# EAGLE design fast_shutdown_v5.0 (EAGLE 9.6.2)
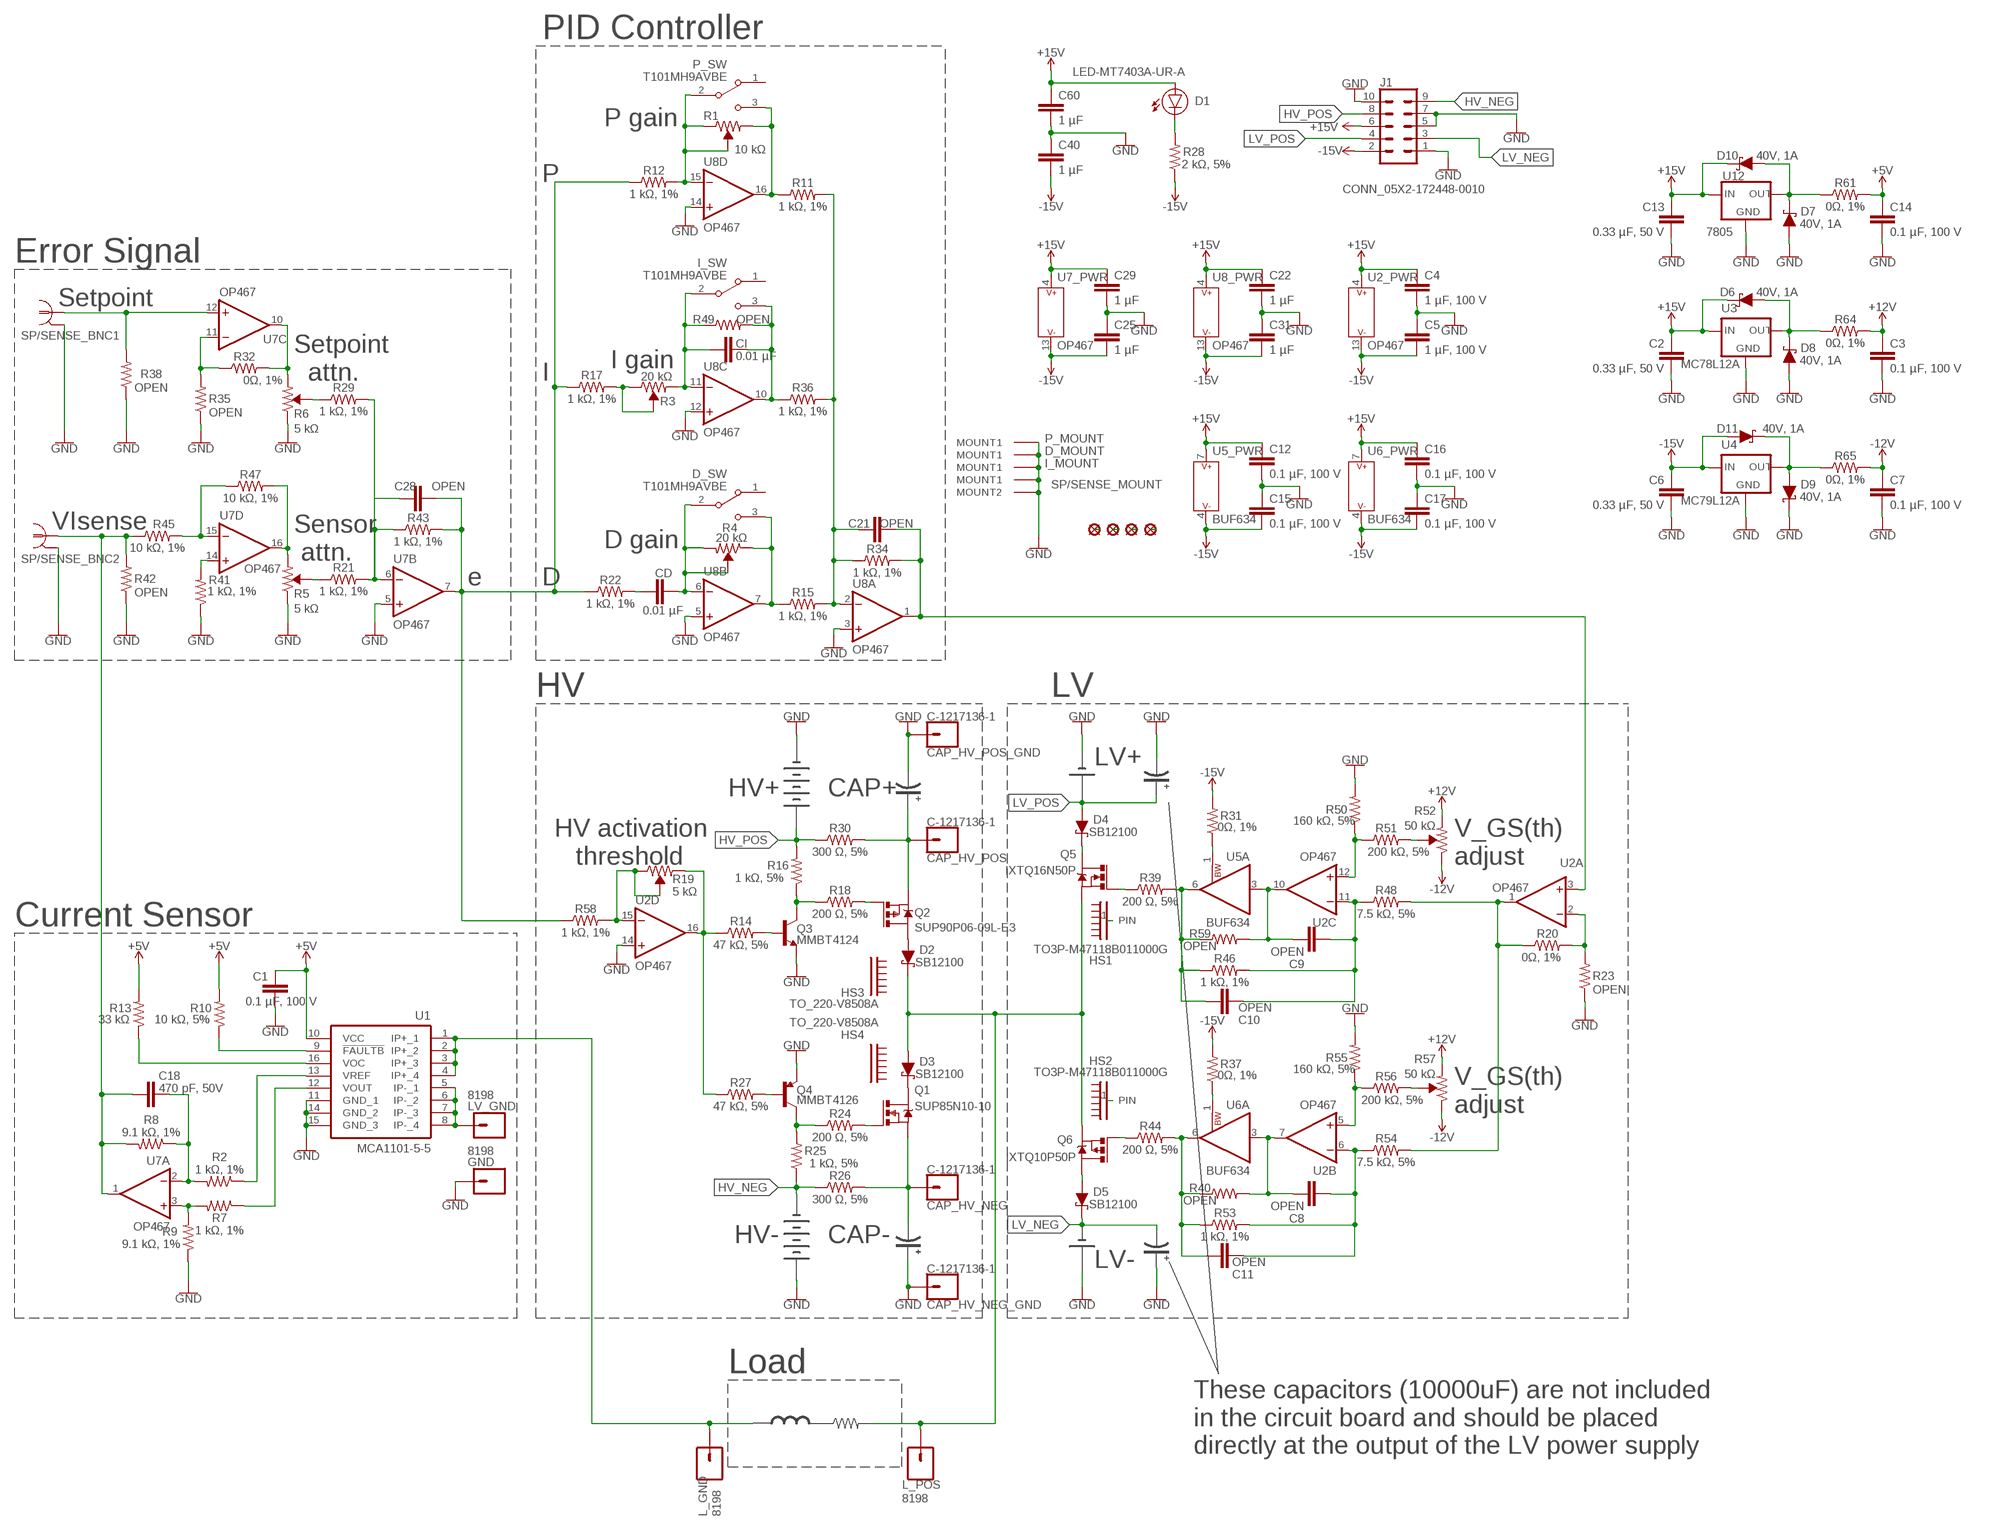
[diagram p0: schematic, sheet 1]

## Parts
C1  0.1 µF, 100 V  0.1µF-C1206C104J1RACTU  [C1206]
C2  0.33 µF, 50 V  0.33µF-CL31B334KBFNNNE  [C1206]
C3  0.1 µF, 100 V  0.1µF-C1206C104J1RACTU  [C1206]
C4  1 µF, 100 V  1µF-C1206X105J1RACTU  [C1206]
C5  1 µF, 100 V  1µF-C1206X105J1RACTU  [C1206]
C6  0.33 µF, 50 V  0.33µF-CL31B334KBFNNNE  [C1206]
C7  0.1 µF, 100 V  0.1µF-C1206C104J1RACTU  [C1206]
C8  OPEN  [C1206_OPEN]
C9  OPEN  [C1206_OPEN]
C10  OPEN  [C1206_OPEN]
C11  OPEN  [C1206_OPEN]
C12  0.1 µF, 100 V  0.1µF-C1206C104J1RACTU  [C1206]
C13  0.33 µF, 50 V  0.33µF-CL31B334KBFNNNE  [C1206]
C14  0.1 µF, 100 V  0.1µF-C1206C104J1RACTU  [C1206]
C15  0.1 µF, 100 V  0.1µF-C1206C104J1RACTU  [C1206]
C16  0.1 µF, 100 V  0.1µF-C1206C104J1RACTU  [C1206]
C17  0.1 µF, 100 V  0.1µF-C1206C104J1RACTU  [C1206]
C18  470 pF, 50V  470ρF-C1206C471K5RACTU  [C1206]
C21  OPEN  [C1206_OPEN]
C22  1 µF  1µF-C1206C105K3RACTU  [C1206]
C25  1 µF  1µF-C1206C105K3RACTU  [C1206]
C28  OPEN  [C1206_OPEN]
C29  1 µF  1µF-C1206C105K3RACTU  [C1206]
C31  1 µF  1µF-C1206C105K3RACTU  [C1206]
C40  1 µF  1µF-C1206C105K3RACTU  [C1206]
C60  1 µF  1µF-C1206C105K3RACTU  [C1206]
CAP_HV_NEG  C-1217136-1  [C-1217136-1]
CAP_HV_NEG_GND  C-1217136-1  [C-1217136-1]
CAP_HV_POS  C-1217136-1  [C-1217136-1]
CAP_HV_POS_GND  C-1217136-1  [C-1217136-1]
CD  0.01 µF  0.01µF-C1206C103K1RACTU  [C1206]
CI  0.01 µF  0.01µF-C1206C103K1RACTU  [C1206]
D  T101MH9AVBE  [T101MH9AVBE]
D1  LED-MT7403A-UR-A  [LED3MM]
D2  SB12100  DIODE_SCHOTTKY-SB12100  [D5.4X7.5]
D3  SB12100  DIODE_SCHOTTKY-SB12100  [D5.4X7.5]
D4  SB12100  DIODE_SCHOTTKY-SB12100  [D5.4X7.5]
D5  SB12100  DIODE_SCHOTTKY-SB12100  [D5.4X7.5]
D6  40V, 1A  DIODE_SCHOTTKY-RB168L-40TFTE25  [DO-214AC]
D7  40V, 1A  DIODE_SCHOTTKY-RB168L-40TFTE25  [DO-214AC]
D8  40V, 1A  DIODE_SCHOTTKY-RB168L-40TFTE25  [DO-214AC]
D9  40V, 1A  DIODE_SCHOTTKY-RB168L-40TFTE25  [DO-214AC]
D10  40V, 1A  DIODE_SCHOTTKY-RB168L-40TFTE25  [DO-214AC]
D11  40V, 1A  DIODE_SCHOTTKY-RB168L-40TFTE25  [DO-214AC]
GND  8198  [8198]
HS1  TO3P-M47118B011000G  [M47118B011000G]
HS2  TO3P-M47118B011000G  [M47118B011000G]
HS3  TO_220-V8508A  [V8508A]
HS4  TO_220-V8508A  [V8508A]
I  T101MH9AVBE  [T101MH9AVBE]
J1  CONN_05X2-172448-0010  [1724480010]
L_GND  8198  [8198]
L_POS  8198  [8198]
LV_GND  8198  [8198]
P  T101MH9AVBE  [T101MH9AVBE]
P1  PAD-M3.0  [PAD_M3.0]
P2  PAD-M3.0  [PAD_M3.0]
P3  PAD-M3.0  [PAD_M3.0]
P4  PAD-M3.0  [PAD_M3.0]
Q1  SUP85N10-10  MOSFET_N-SUP85N10-10-GE3  [TO220AB_BL]
Q2  SUP90P06-09L-E3  MOSFET_P-SUP90P06-09L-E3  [TO220AB_BL]
Q3  MMBT4124  BJT_NPN-MMBT4124LT1G  [SOT23]
Q4  MMBT4126  BJT_PNP-MMBT4126LT1G  [SOT23]
Q5  IXTQ16N50P  MOSFET_N-IXTQ16N50P  [TO3P]
Q6  IXTQ10P50P  MOSFET_P-IXTQ10P50P  [TO3P]
R1  10 kΩ  TRIMMER_3006P-10K  [POT_3006P]
R2  1 kΩ, 1%  1KΩ-RC1206FR-071KL  [R1206]
R3  20 kΩ  TRIMMER_3006P-20K  [POT_3006P]
R4  20 kΩ  TRIMMER_3006P-20K  [POT_3006P]
R5  5 kΩ  TRIMMER_3006P-5K  [POT_3006P]
R6  5 kΩ  TRIMMER_3006P-5K  [POT_3006P]
R7  1 kΩ, 1%  1KΩ-RC1206FR-071KL  [R1206]
R8  9.1 kΩ, 1%  9.1KΩ-RC1206FR-079K1L  [R1206]
R9  9.1 kΩ, 1%  9.1KΩ-RC1206FR-079K1L  [R1206]
R10  10 kΩ, 5%  10KΩ-RC1206JR-0710KL  [R1206]
R11  1 kΩ, 1%  1KΩ-RC1206FR-071KL  [R1206]
R12  1 kΩ, 1%  1KΩ-RC1206FR-071KL  [R1206]
R13  33 kΩ  NOVA  [R1206]
R14  47 kΩ, 5%  47KΩ-RC1206JR-0747KL  [R1206]
R15  1 kΩ, 1%  1KΩ-RC1206FR-071KL  [R1206]
R16  1 kΩ, 5%  1KΩ-RC1206JR-071KL  [R1206]
R17  1 kΩ, 1%  1KΩ-RC1206FR-071KL  [R1206]
R18  200 Ω, 5%  200Ω-RC1206JR-07200RL  [R1206]
R19  5 kΩ  TRIMMER_3006P-5K  [POT_3006P]
R20  0Ω, 1%  0Ω-RC1206FR-070RL  [R1206]
R21  1 kΩ, 1%  1KΩ-RC1206FR-071KL  [R1206]
R22  1 kΩ, 1%  1KΩ-RC1206FR-071KL  [R1206]
R23  OPEN  OPEN-1206  [R1206_OPEN]
R24  200 Ω, 5%  200Ω-RC1206JR-07200RL  [R1206]
R25  1 kΩ, 5%  1KΩ-RC1206JR-071KL  [R1206]
R26  300 Ω, 5%  300Ω-RC1206JR-07300RL  [R1206]
R27  47 kΩ, 5%  47KΩ-RC1206JR-0747KL  [R1206]
R28  2 kΩ, 5%  2KΩ-RC1206JR-072KL  [R1206]
R29  1 kΩ, 1%  1KΩ-RC1206FR-071KL  [R1206]
R30  300 Ω, 5%  300Ω-RC1206JR-07300RL  [R1206]
R31  0Ω, 1%  0Ω-RC1206FR-070RL  [R1206]
R32  0Ω, 1%  0Ω-RC1206FR-070RL  [R1206]
R34  1 kΩ, 1%  1KΩ-RC1206FR-071KL  [R1206]
R35  OPEN  OPEN-1206  [R1206_OPEN]
R36  1 kΩ, 1%  1KΩ-RC1206FR-071KL  [R1206]
R37  0Ω, 1%  0Ω-RC1206FR-070RL  [R1206]
R38  OPEN  OPEN-1206  [R1206_OPEN]
R39  200 Ω, 5%  200Ω-RC1206JR-07200RL  [R1206]
R40  OPEN  OPEN-1206  [R1206_OPEN]
R41  1 kΩ, 1%  1KΩ-RC1206FR-071KL  [R1206]
R42  OPEN  OPEN-1206  [R1206_OPEN]
R43  1 kΩ, 1%  1KΩ-RC1206FR-071KL  [R1206]
R44  200 Ω, 5%  200Ω-RC1206JR-07200RL  [R1206]
R45  10 kΩ, 1%  10KΩ-RC1206FR-0710KL  [R1206]
R46  1 kΩ, 1%  1KΩ-RC1206FR-071KL  [R1206]
R47  10 kΩ, 1%  10KΩ-RC1206FR-0710KL  [R1206]
R48  7.5 kΩ, 5%  7.5KΩ-RC1206JR-077K5L  [R1206]
R49  OPEN  OPEN-1206  [R1206_OPEN]
R50  160 kΩ, 5%  160KΩ-RC1206JR-07160KL  [R1206]
R51  200 kΩ, 5%  200KΩ-RC1206JR-07200KL  [R1206]
R52  50 kΩ  TRIMMER_3006P-50K  [POT_3006P]
R53  1 kΩ, 1%  1KΩ-RC1206FR-071KL  [R1206]
R54  7.5 kΩ, 5%  7.5KΩ-RC1206JR-077K5L  [R1206]
R55  160 kΩ, 5%  160KΩ-RC1206JR-07160KL  [R1206]
R56  200 kΩ, 5%  200KΩ-RC1206JR-07200KL  [R1206]
R57  50 kΩ  TRIMMER_3006P-50K  [POT_3006P]
R58  1 kΩ, 1%  1KΩ-RC1206FR-071KL  [R1206]
R59  OPEN  OPEN-1206  [R1206_OPEN]
R61  0Ω, 1%  0Ω-RC1206FR-070RL  [R1206]
R64  0Ω, 1%  0Ω-RC1206FR-070RL  [R1206]
R65  0Ω, 1%  0Ω-RC1206FR-070RL  [R1206]
SP/SENSE  BNC2_CHG-5227161-1  [5227161-1_CHG]
U1  MCA1101-5-5  MCA1101-5-5-MCA1101-5-5  [SOIC16-W]
U2  OP467  OP467-OP467GSZ  [SOIC16-W]
U3  MC78L12A  MC78L12A-MC78L12ABDR2G  [SOIC8-N]
U4  MC79L12A  MC79L12A-MC79L12ABDR2G  [SOIC8-N]
U5  BUF634  BUF634-BUF634AIDR  [SOIC8-N]
U6  BUF634  BUF634-BUF634AIDR  [SOIC8-N]
U7  OP467  OP467-OP467GSZ  [SOIC16-W]
U8  OP467  OP467-OP467GSZ  [SOIC16-W]
U12  7805  MC7805CT-L7805CDT-TR  [DPAK]

## Nets
+5V: C1.1 C14.1 R10.2 R13.2 R61.2 U1.10(VCC)
+12V: C3.1 R52.1(CCW) R57.1(CCW) R64.2
+15V: C2.1 C4.1 C12.1 C13.1 C16.1 C22.1 C29.1 C60.1 D1.A D6.K(C) D10.K(C) J1.6 U2.4(_PWR:P$V+) U3.8(IN) U5.7(_PWR:P$V+) U6.7(_PWR:P$V+) U7.4(_PWR:P$V+) U8.4(_PWR:P$V+) U12.1(IN)
-12V: C7.1 R52.3(CW) R57.3(CW) R65.2
-15V: C5.2 C6.1 C15.2 C17.2 C25.2 C31.2 C40.2 D11.A J1.2 R28.1 R31.2 R37.2 U2.13(_PWR:P$V-) U4.2(IN) U4.3(IN) U4.6(IN) U4.7(IN) U5.4(_PWR:P$V-) U6.4(_PWR:P$V-) U7.13(_PWR:P$V-) U8.13(_PWR:P$V-)
CAP_HV_NEG: CAP_HV_NEG.1 CAP_HV_NEG.2 Q1.3(S) R26.2
CAP_HV_POS: CAP_HV_POS.1 CAP_HV_POS.2 Q2.3(S) R30.2
GND: C1.2 C2.2 C3.2 C4.2 C5.1 C6.2 C7.2 C12.2 C13.2 C14.2 C15.1 C16.2 C17.1 C22.2 C25.1 C29.2 C31.1 C40.1 C60.2 CAP_HV_NEG_GND.1 CAP_HV_NEG_GND.2 CAP_HV_POS_GND.1 CAP_HV_POS_GND.2 D7.A D8.A D9.K(C) D.H1(_MOUNT:MOUNT1) GND.1 GND.2 I.H1(_MOUNT:MOUNT1) J1.1 J1.5 J1.7 J1.10 P.H1(_MOUNT:MOUNT1) Q3.2(E) Q4.2(E) R5.3(CW) R6.3(CW) R9.1 R23.1 R35.1 R38.1 R41.1 R42.1 R50.2 R55.2 SP/SENSE.2 SP/SENSE.4 SP/SENSE.H1(_MOUNT:MOUNT1) SP/SENSE.H2(_MOUNT:MOUNT2) SP/SENSE.H3(_MOUNT:MOUNT1) SP/SENSE.H5(_MOUNT:MOUNT1) SP/SENSE.H6(_MOUNT:MOUNT2) U1.11(GND_1) U1.14(GND_2) U1.15(GND_3) U2.14(D:+IN) U3.2(GND) U3.3(GND) U3.6(GND) U3.7(GND) U4.5(GND) U7.5(B:+IN) U8.3(A:+IN) U8.5(B:+IN) U8.12(C:+IN) U8.14(D:+IN) U12.4(GND)
HV_NEG: J1.9 R25.1 R26.1
HV_POS: J1.8 R16.2 R30.1
LV_NEG: D5.1(C) J1.3
LV_POS: D4.2(A) J1.4
N$1: C18.2 R8.2 R42.2 R45.1 SP/SENSE.3 U7.1(A:OUT)
N$2: R45.2 R47.1 U7.15(D:-IN)
N$3: R5.1(CCW) R47.2 U7.16(D:OUT)
N$4: D.3(_SW:NO) R4.3(CW) R15.1 U8.7(B:OUT)
N$5: C21.2 R34.2 U2.3(A:+IN) U8.1(A:OUT)
N$6: R41.2 U7.14(D:+IN)
N$7: R5.2(WIPER) R21.1
N$8: C28.1 R21.2 R29.2 R43.1 U7.6(B:-IN)
N$9: P1.1(H) P1.2(H) P1.3(H) P1.4(H) P1.5(H) P1.6(H) P1.7(H) P1.8(H) P1.P
N$10: R32.1 R35.2 U7.11(C:-IN)
N$11: R6.1(CCW) R32.2 U7.10(C:OUT)
N$12: R6.2(WIPER) R29.1
N$13: L_GND.1 L_GND.2 U1.1(IP+_1) U1.2(IP+_2) U1.3(IP+_3) U1.4(IP+_4)
N$14: C21.1 R11.2 R15.2 R34.1 R36.2 U8.2(A:-IN)
N$15: Q3.3(C) R16.1 R18.1
N$16: R2.1 U1.13(VREF)
N$17: R7.1 U1.12(VOUT)
N$18: R20.1 R48.2 R54.2 U2.1(A:OUT)
N$19: LV_GND.1 LV_GND.2 U1.5(IP-_1) U1.6(IP-_2) U1.7(IP-_3) U1.8(IP-_4)
N$20: R20.2 R23.2 U2.2(A:-IN)
N$21: C28.2 R12.1 R17.1 R22.1 R43.2 R58.1 U7.7(B:OUT)
N$22: R38.2 SP/SENSE.1 U7.12(C:+IN)
N$23: P2.1(H) P2.2(H) P2.3(H) P2.4(H) P2.5(H) P2.6(H) P2.7(H) P2.8(H) P2.P
N$24: D2.1(C) D3.2(A) L_POS.1 L_POS.2 Q5.3(S) Q6.3(S)
N$26: P.2(_SW:COMMON) R1.2(WIPER) R1.3(CW) R12.2 U8.15(D:-IN)
N$27: P.3(_SW:NO) R1.1(CCW) R11.1 U8.16(D:OUT)
N$29: C10.2 R39.2 R46.1 R59.1 U5.6(A:OUT)
N$30: CI.1 I.2(_SW:COMMON) R3.1(CCW) R49.1 U8.11(C:-IN)
N$31: CI.2 I.3(_SW:NO) R36.1 R49.2 U8.10(C:OUT)
N$32: R3.2(WIPER) R3.3(CW) R17.2
N$36: CD.2 D.2(_SW:COMMON) R4.1(CCW) R4.2(WIPER) U8.6(B:-IN)
N$38: CD.1 R22.2
N$41: C9.2 R59.2 U2.10(C:OUT) U5.3(A:IN)
N$61: C8.2 R40.2 U2.7(B:OUT) U6.3(A:IN)
N$62: R31.1 U5.1(A:BW)
N$63: R37.1 U6.1(A:BW)
N$64: D1.K(C) R28.2
N$65: D7.K(C) D10.A R61.1 U12.3(OUT)
N$66: D6.A D8.K(C) R64.1 U3.1(OUT)
N$67: D9.A D11.K(C) R65.1 U4.1(OUT)
N$68: HS2.1(PIN)
N$69: P3.1(H) P3.2(H) P3.3(H) P3.4(H) P3.5(H) P3.6(H) P3.7(H) P3.8(H) P3.P
N$70: HS1.1(PIN)
N$71: P4.1(H) P4.2(H) P4.3(H) P4.4(H) P4.5(H) P4.6(H) P4.7(H) P4.8(H) P4.P
N$75: R50.1 R51.1 U2.12(C:+IN)
N$79: C18.1 R2.2 R8.1 U7.2(A:-IN)
N$123: R7.2 R9.2 U7.3(A:+IN)
N$130: R10.1 U1.9(!FAULTB)
N$131: R13.1 U1.16(VOC)
N$132: Q3.1(B) R14.2
N$133: Q2.1(G) R18.2
N$135: D5.2(A) Q6.2(D)
N$136: D2.2(A) Q2.2(D)
N$137: D3.1(C) Q1.2(D)
N$138: Q1.1(G) R24.2
N$139: Q4.3(C) R24.1 R25.2
N$140: Q4.1(B) R27.2
N$145: D4.1(C) Q5.2(D)
N$148: Q6.1(G) R44.1
N$150: Q5.1(G) R39.1
N$152: C9.1 C10.1 R46.2 R48.1 U2.11(C:-IN)
N$153: R51.2 R52.2(WIPER)
N$154: C8.1 C11.1 R53.2 R54.1 U2.6(B:-IN)
N$155: R55.1 R56.1 U2.5(B:+IN)
N$156: R56.2 R57.2(WIPER)
N$157: C11.2 R40.1 R44.2 R53.1 U6.6(A:OUT)
N$158: R19.2(WIPER) R19.3(CW) R58.2 U2.15(D:-IN)
N$159: R14.1 R19.1(CCW) R27.1 U2.16(D:OUT)
Unconnected: D.1(_SW:NC) I.1(_SW:NC) P.1(_SW:NC)

## Notes on the sheet
- PID Controller
- P gain
- P
- Error Signal
- Setpoint
- I gain
- Setpoint
    attn.
- I
- VIsense
- D gain
- Sensor 
   attn.
- e | D
- HV | LV
- LV+
- HV+ | CAP+
- HV activation
     threshold
- V_GS(th) 
  adjust
- Current Sensor
- V_GS(th)
  adjust
- HV- | CAP-
- LV-
- Load
- These capacitors (10000uF) are not included
  in the circuit board and should be placed
  directly at the output of the LV power supply

## Library data of the parts
C1 C3 C7 C12 C14-C17 = IFUNAM-Capacitors:0.1µF: 0.1 µF Ceramic Capacitor; MFR: KEMET; MFR#: C1206C104J1RACTU; MOUSER#: 80-C1206C104J1R
C2 C6 C13 = IFUNAM-Capacitors:0.33µF: 0.33 µF Capacitor; MFR: Samsung Electro-Mechanics; MFR#: CL31B334KBFNNNE; MOUSER#: 187-CL31B334KBFNNNE
C4 C5 = IFUNAM-Capacitors:1µF: 1 µF Capacitor; MFR: KEMET; MFR#: C1206X105J1RACTU; MOUSER#: 80-C1206X105J1R
C8-C11 C21 C28 = IFUNAM-Capacitors:OPEN: OPEN; DIGIKEY#: NA; MFR: NA; MFR#: NA
C18 = IFUNAM-Capacitors:470ρF: Multilayer Ceramic Capacitors MLCC - SMD/SMT 50V 470pF X7R 1206 10%; MFR: KEMET; MFR#: C1206C471K5RACTU; MOUSER#: 80-C1206C471K5R
C22 C25 C29 C31 C40 C60 = IFUNAM-Capacitors:1µF: 1 µF Capacitor; DIGIKEY#: 399-1255-1-ND; MFR: KEMET; MFR#: C1206C105K3RACTU
CAP_HV_NEG CAP_HV_NEG_GND CAP_HV_POS CAP_HV_POS_GND = IFUNAM-Teminals:C-1217136-1: PCB Terminal, 6.35mm x 0.81mm, 0.25" x 0.032", Brass, 1.4 mm, Tin, FASTON 250 Series; MFR: AMP - TE CONNECTIVITY; MFR#: 1217136-1; NEWARK#: 17R2801
CD CI = IFUNAM-Capacitors:0.01µF: 0.01 µF Capacitor; DIGIKEY#: 399-1236-1-ND; MFR: KEMET; MFR#: C1206C103K1RACTU
D I P = IFUNAM-Switches:T101MH9AVBE: Toggle Switches ON-ON SPDT R/A PCB; MFR: C&K; MFR#: T101MH9AVBE; MOUSER#: 611-T101-005
D1 = IFUNAM-Diodes:LED: LED; DIGIKEY#: 1125-1181-ND; MFR: Marktech Optoelectronics; MFR#: MT7403A-UR-A
D2-D5 = IFUNAM-Diodes:DIODE_SCHOTTKY: Schottky Diodes & Rectifiers Schottky; MFR: Diotec Semiconductor; MFR#: SB12100; MOUSER#: 637-SB12100
D6-D11 = IFUNAM-Diodes:DIODE_SCHOTTKY: Schottky Diodes & Rectifiers Schottky; MFR: ROHM Semiconductor; MFR#: RB168L-40TFTE25; MOUSER#: 755-RB168L-40TFTE25
GND L_GND L_POS LV_GND = IFUNAM-Teminals:8198: Terminals PC SCRW TYPE TERM; MFR: Keystone Electronics; MFR#: 8198; MOUSER#: 534-8198
HS1 HS2 = IFUNAM-Heatsinks:TO3P: Heat Sinks Max Clip Heat Sink, TO247, TO220, TO126, Solder Pins, 19.4x30.15x31.5mm, Clip; MFR: Aavid; MFR#: M47118B011000G; MOUSER#: 532-M47118B011000G
HS3 HS4 = IFUNAM-Heatsinks:TO_220: Heat Sink TO-220 Aluminum 3.0W @ 60°C Board Level; DIGIKEY#: A10759-ND; MFR: Assmann WSW Components; MFR#: V8508A
J1 = IFUNAM-Connectors:CONN_05X2: Connector 10 position; MFR: Molex; MFR#: 172448-0010; MOUSER#: 538-172448-0010
P1-P4 = IFUNAM-Boards:PAD
Q1 = IFUNAM-Transistors:MOSFET_N: Metal-Oxide-Semiconductor Field-Effect Transistors - N-CH; MFR: Vishay / Siliconix; MFR#: SUP85N10-10-GE3; MOUSER#: 781-SUP85N10-10-GE3
Q2 = IFUNAM-Transistors:MOSFET_P: Metal-Oxide-Semiconductor Field-Effect Transistors - P-CH; MFR: Vishay Semiconductors; MFR#: SUP90P06-09L-E3; MOUSER#: 781-SUP90P06-09L-E3
Q3 = IFUNAM-Transistors:BJT_NPN: Bipolar Transistors - NPN; MFR: onsemi; MFR#: MMBT4124LT1G; MOUSER#: 863-MMBT4124LT1G
Q4 = IFUNAM-Transistors:BJT_PNP: Bipolar Transistors - PNP; MFR: onsemi; MFR#: MMBT4126LT1G; MOUSER#: 863-MMBT4126LT1G
Q5 = IFUNAM-Transistors:MOSFET_N: Metal-Oxide-Semiconductor Field-Effect Transistors - N-CH; MFR: IXYS; MFR#: IXTQ16N50P; MOUSER#: 747-IXTQ16N50P
Q6 = IFUNAM-Transistors:MOSFET_P: Metal-Oxide-Semiconductor Field-Effect Transistors - P-CH; MFR: IXYS; MFR#: IXTQ10P50P; MOUSER#: 747-IXTQ10P50P
R1 = IFUNAM-Resistors:TRIMMER_3006P: 0.75W, 3/4W PC Pins Through Hole Trimmer Potentiometer Cermet 15 Turn Side Adjustment; DIGIKEY#: 3006P-103LF-ND; MFR: Bourns Inc.; MFR#: 3006P-1-103LF
R2 R7 R11 R12 R15 R17 R21 R22 R29 R34 R36 R41 R43 R46 R53 R58 = IFUNAM-Resistors:1KΩ: Resistor, 1 kΩ; DIGIKEY#: 311-1.00KFRCT-ND; MFR: Yageo; MFR#: RC1206FR-071KL; MOUSER#: 603-RC1206FR-071KL
R3 R4 = IFUNAM-Resistors:TRIMMER_3006P: 0.75W, 3/4W PC Pins Through Hole Trimmer Potentiometer Cermet 15 Turn Side Adjustment; DIGIKEY#: 3006P-203LF-ND; MFR: Bourns Inc.; MFR#: 3006P-1-203LF
R5 R6 R19 = IFUNAM-Resistors:TRIMMER_3006P: 0.75W, 3/4W PC Pins Through Hole Trimmer Potentiometer Cermet 15 Turn Side Adjustment; DIGIKEY#: 3006P-502LF-ND; MFR: Bourns Inc.; MFR#: 3006P-1-502LF
R8 R9 = IFUNAM-Resistors:9.1KΩ: Resistor 9.1 kΩ; MFR: Yageo; MFR#: RC1206FR-079K1L; MOUSER#: 603-RC1206FR-079K1L
R10 = IFUNAM-Resistors:10KΩ: Resistor, 10 kΩ; MFR: Yageo; MFR#: RC1206JR-0710KL; MOUSER#: 603-RC1206JR-0710KL
R13 = IFUNAM-Resistors:NOVA: Generic 1206 resistor for the one from the NOVA folder SMR-03 <https://mexico.newark.com/nova/smr-03/resistors-chip-kit-1206-e24/dp/96M8369?scope=partnumberlookahead&ost=96M8369&searchref=searchlookahead&exaMfpn=true&ddkey=https%3Aes-MX%2FElement14_Mexico%2Fw%2Fsearch>. Available values: 1.0 Ω 1.1 Ω 1.2 Ω 1.3 Ω 1.5 Ω 1.6 Ω 1.8 Ω 2.0 Ω 2.2 Ω 2.4 Ω 2.7 Ω 3.0 Ω 3.3 Ω 3.6 Ω 3.9 Ω 4.3 Ω 4.7 Ω 5.1 Ω 5.6 Ω 6.2 Ω 6.8 Ω 7.5 Ω 8.2 Ω 9.1 Ω 10 Ω 11 Ω 12 Ω 13 Ω 15 Ω 16 Ω 18 Ω 20 Ω 22 Ω 24 Ω 27 Ω 30 Ω 33 Ω 36 Ω 39 Ω 43 Ω 47 Ω 51 Ω 56 Ω 62 Ω 68 Ω 75 Ω 82 Ω 91 Ω 10 Ω 11 Ω 12 Ω 13 Ω 15 Ω 16 Ω 18 Ω 20 Ω 22 Ω 24 Ω 27 Ω 30 Ω 33 Ω 36 Ω 39 Ω 43 Ω 47 Ω 51 Ω 56 Ω 62 Ω 68 Ω 75 Ω 82 Ω 91 Ω 1.0 kΩ 1.1 kΩ 1.2 kΩ 1.3 kΩ 1.5 kΩ 1.6 kΩ 1.8 kΩ 2.0 kΩ 2.2 kΩ 2.4 kΩ 2.7 kΩ 3.0 kΩ 3.3 kΩ 3.6 kΩ 3.9 kΩ 4.3 kΩ 4.7 kΩ 5.1 kΩ 5.6 kΩ 6.2 kΩ 6.8 kΩ 7.5 kΩ 8.2 kΩ 9.1 kΩ 1.0 kΩ 1.1 kΩ 1.2 kΩ 1.3 kΩ 1.5 kΩ 1.6 kΩ 1.8 kΩ 2.0 kΩ 2.2 kΩ 2.4 kΩ 2.7 kΩ 3.0 kΩ 3.3 kΩ 3.6 kΩ 3.9 kΩ 4.3 kΩ 4.7 kΩ 5.1 kΩ 5.6 kΩ 6.2 kΩ 6.8 kΩ 7.5 kΩ 8.2 kΩ 9.1 kΩ 100 kΩ 110 kΩ 120 kΩ 130 kΩ 150 kΩ 160 kΩ 180 kΩ 200 kΩ 220 kΩ 240 kΩ 270 kΩ 300 kΩ 330 kΩ 360 kΩ 390 kΩ 430 kΩ 470 kΩ 510 kΩ 560 kΩ 620 kΩ 680 kΩ 750 kΩ 820 kΩ 910 kΩ 100 kΩ 110 kΩ 120 kΩ 130 kΩ 150 kΩ 160 kΩ 180 kΩ 200 kΩ 220 kΩ 240 kΩ 270 kΩ 300 kΩ 330 kΩ 360 kΩ 390 kΩ 430 kΩ 470 kΩ 510 kΩ 560 kΩ 620 kΩ 680 kΩ 750 kΩ 820 kΩ 910 kΩ; VALUE: ?
R14 R27 = IFUNAM-Resistors:47KΩ: 47 kΩ Resistor; MFR: YAGEO; MFR#: RC1206JR-0747KL; MOUSER#: 603-RC1206JR-0747KL
R16 R25 = IFUNAM-Resistors:1KΩ: Resistor, 1 kΩ; MFR: Yageo; MFR#: RC1206JR-071KL; MOUSER#: 603-RC1206JR-071KL
R18 R24 R39 R44 = IFUNAM-Resistors:200Ω: 200 Ω Resistor; MFR: YAGEO; MFR#: RC1206JR-07200RL; MOUSER#: 603-RC1206JR-07200RL
R20 R31 R32 R37 R61 R64 R65 = IFUNAM-Resistors:0Ω: 0Ω Jumper; MFR: YAGEO; MFR#: RC1206FR-070RL; MOUSER#: 603-RC1206FR-070RL
R23 R35 R38 R40 R42 R49 R59 = IFUNAM-Resistors:OPEN: OPEN; MFR: NA; MFR#: NA; MOUSER#: NA
R26 R30 = IFUNAM-Resistors:300Ω: 300 Ω Resistor; MFR: Yageo; MFR#: RC1206JR-07300RL; MOUSER#: 603-RC1206JR-07300RL
R28 = IFUNAM-Resistors:2KΩ: 2 kΩ resistor; MFR: YAGEO; MFR#: RC1206JR-072KL; MOUSER#: 603-RC1206JR-072KL
R45 R47 = IFUNAM-Resistors:10KΩ: Resistor, 10 kΩ; MFR: Yageo; MFR#: RC1206FR-0710KL; MOUSER#: 603-RC1206FR-0710K
R48 R54 = IFUNAM-Resistors:7.5KΩ: Resistor 7.5 kΩ; MFR: Yageo; MFR#: RC1206JR-077K5L; MOUSER#: 603-RC1206JR-077K5L
R50 R55 = IFUNAM-Resistors:160KΩ: 160 kΩ Resistor; MFR: YAGEO; MFR#: RC1206JR-07160KL; MOUSER#: 603-RC1206JR-07160KL
R51 R56 = IFUNAM-Resistors:200KΩ: 200 kΩ Resistor; MFR: YAGEO; MFR#: RC1206JR-07200KL; MOUSER#: 603-RC1206JR-07200KL
R52 R57 = IFUNAM-Resistors:TRIMMER_3006P: 0.75W, 3/4W PC Pins Through Hole Trimmer Potentiometer Cermet 15 Turn Side Adjustment; DIGIKEY#: 3006P-503LF-ND; MFR: Bourns Inc.; MFR#: 3006P-1-503LF
SP/SENSE = IFUNAM-Connectors:BNC2_CHG: BNC Connector Jack, Female Socket 50Ohm Panel Mount, Through Hole; DIGIKEY#: A32244-ND; MFR: TE Connectivity AMP Connectors; MFR#: 5227161-1
U1 = IFUNAM-IC-Conversion:MCA1101-5-5: Board Mount Current Sensors 5A, 5V, Fix gain, 1.5MHz BW, Galvanic isolation.; MFR: ACEINNA; MFR#: MCA1101-5-5; MOUSER#: 438-MCA1101-5-5
U2 U7 U8 = IFUNAM-IC-Amplifiers:OP467: General Purpose Amplifier 4 Circuit; MFR: Analog Devices Inc.; MFR#: OP467GSZ; MOUSER#: 584-OP467GSZ
U3 = IFUNAM-VoltageRegulators:MC78L12A: Linear Voltage Regulators 12V 100mA Positive; MFR: onsemi; MFR#: MC78L12ABDR2G; MOUSER#: 863-MC78L12ABDR2G
U4 = IFUNAM-VoltageRegulators:MC79L12A: Linear Voltage Regulators 12V 100mA Negative; MFR: onsemi; MFR#: MC79L12ABDR2G; MOUSER#: 863-MC79L12ABDR2G
U5 U6 = IFUNAM-IC-Amplifiers:BUF634: High Speed Operational Amplifiers 210-MHz, 250-mA high-speed buffer; MFR: Texas Instruments; MFR#: BUF634AIDR; MOUSER#: 595-BUF634AIDR
U12 = IFUNAM-VoltageRegulators:MC7805CT: Linear Voltage Regulator IC Positive Fixed 1 Output 5V 1A; MFR: STMicroelectronics; MFR#: L7805CDT-TR; MOUSER#: 511-L7805CDT-TR

## Board
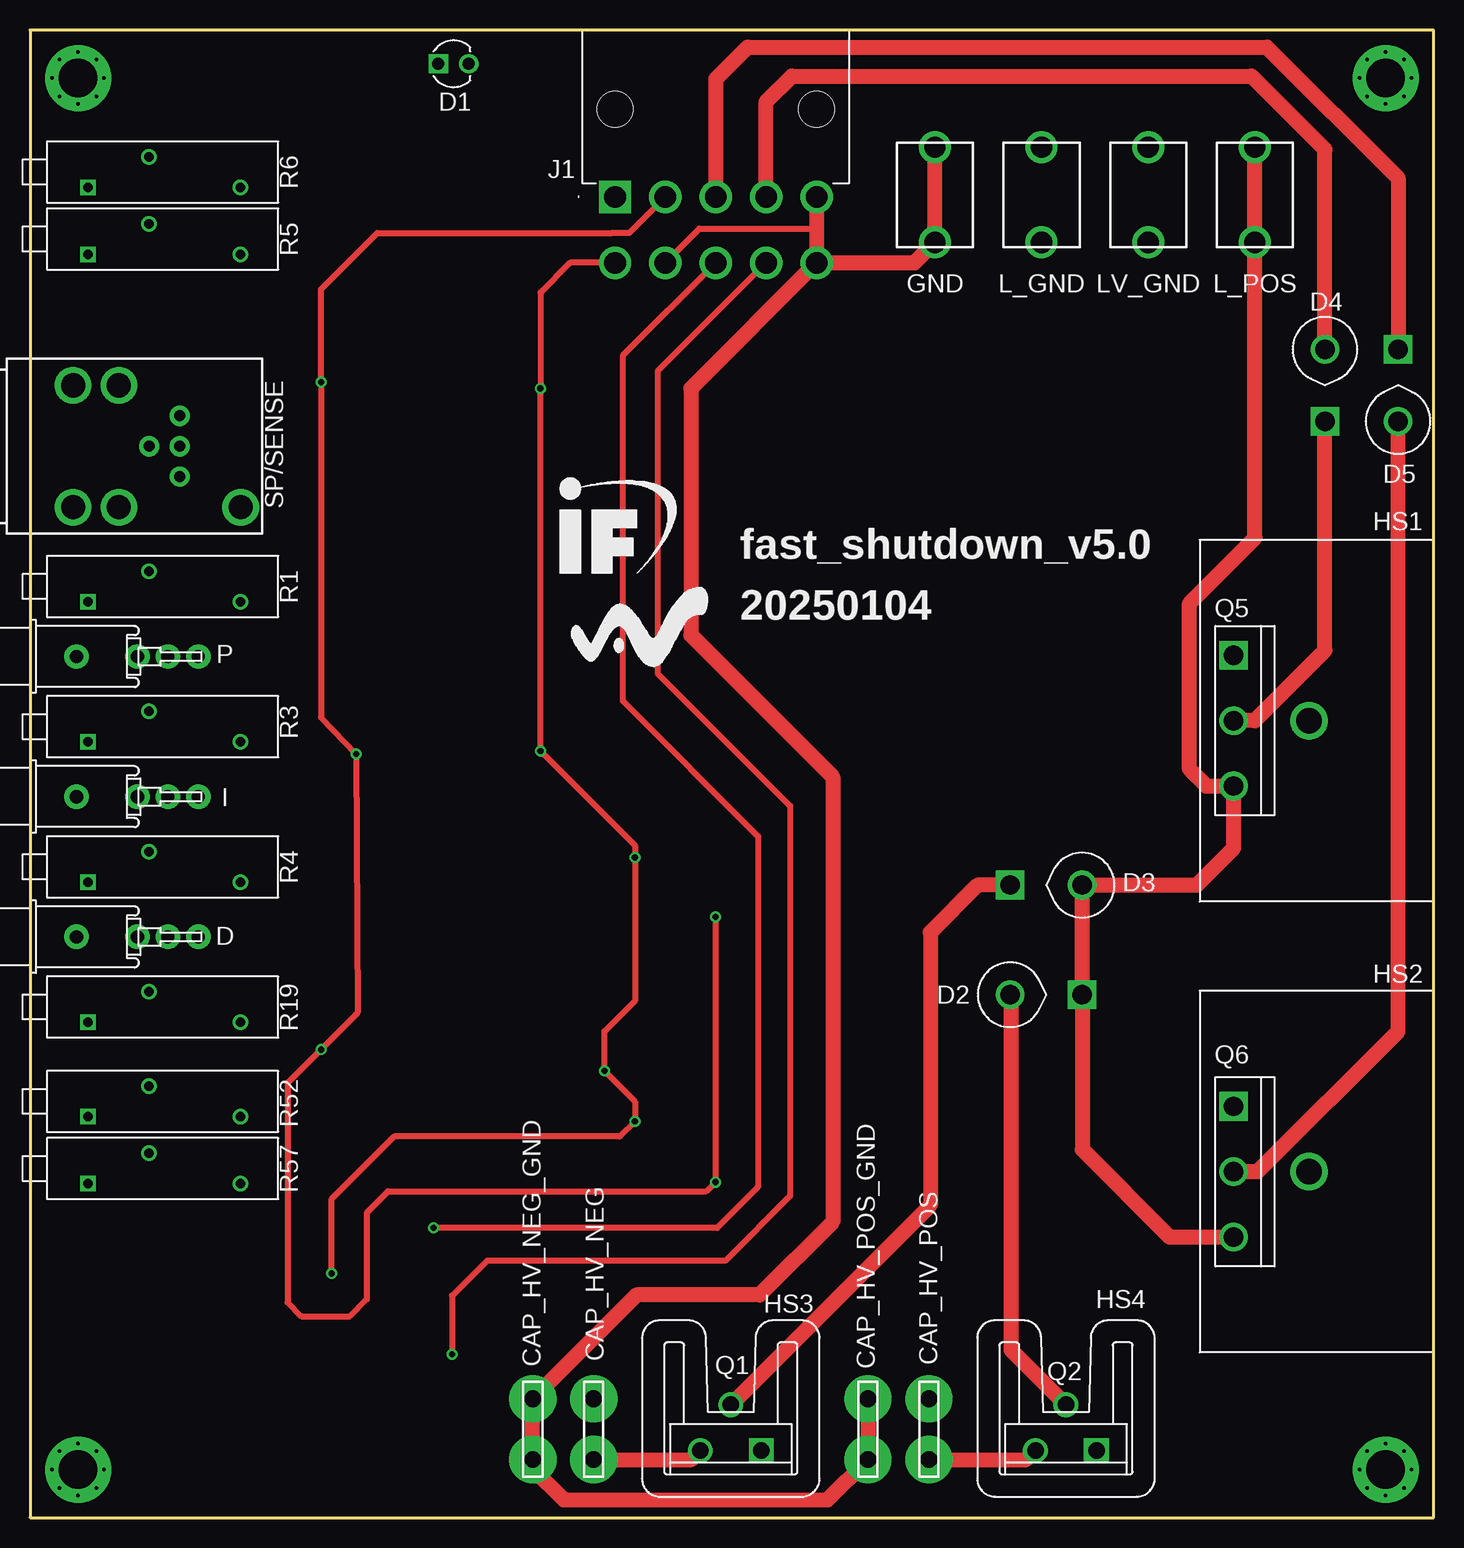
[diagram p1: board, top side]
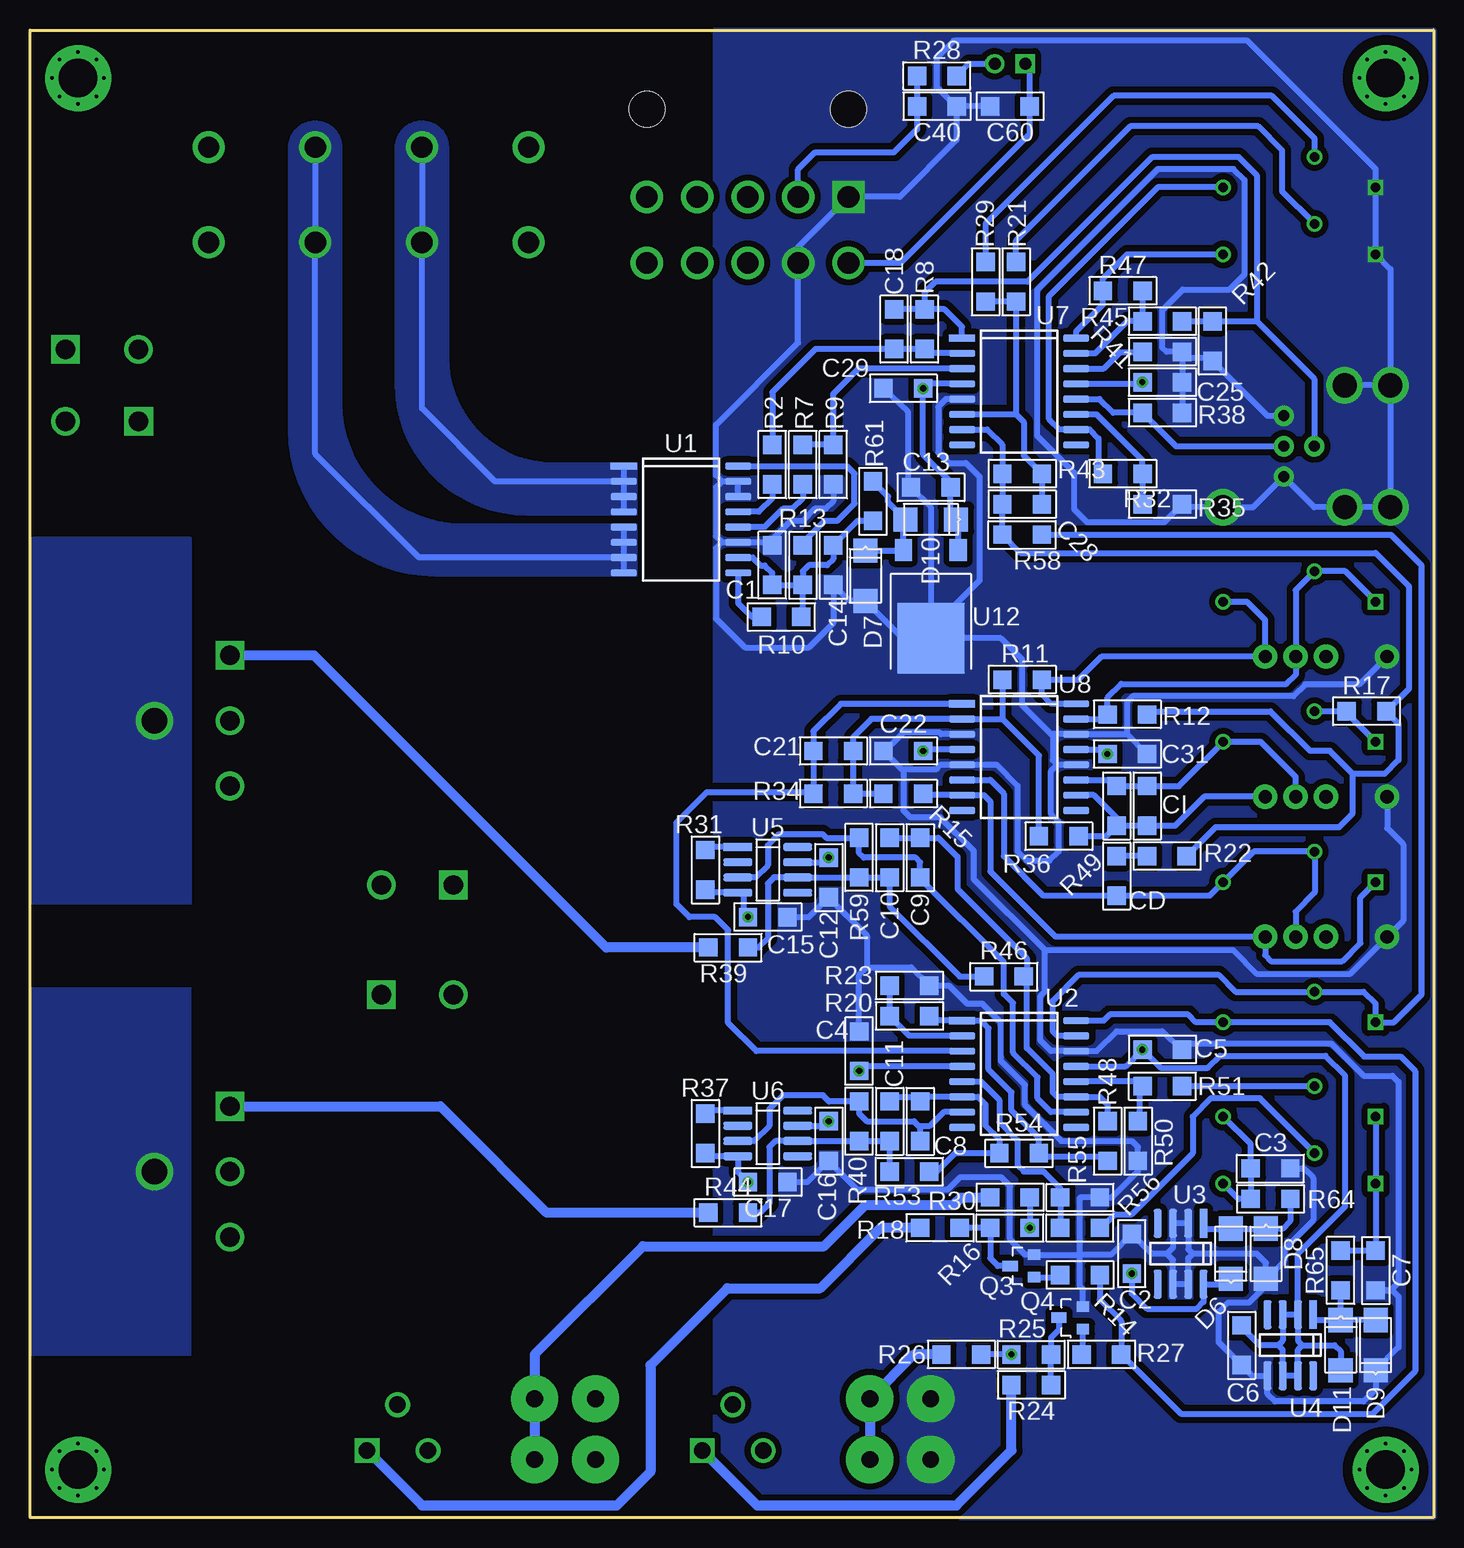
[diagram p2: board, bottom side, seen from below]

Size 117 x 124 mm. Coordinates in mm from the lower left corner, seen from the top.
Outline: 0,124 0,0 117,0 117,124 0,124
Copper layers (1*16): Top 0.035mm / dielectric 1.5mm / Bottom 0.035mm
Design rules "default *": minimum track width 6mil, minimum drill 12mil, track to track 20mil, track to pad 20mil, pad to pad 20mil, via to via 20mil, smd to smd 0mil, copper to edge 0mil, drill to drill 6mil, minimum pad ring 10mil, minimum via ring 8mil, stop-mask expansion 4mil, vias tented up to drill 20mil, thermal gap 10mil

### Footprints (pad centres in the part's own frame; a part is rotated, then mirrored left to right if it is on the bottom)
C1206 = smd 1.524 x 1.524: 1 -1.651,0; 2 1.651,0
C1206_OPEN = smd 1.524 x 1.524: 1 -1.651,0; 2 1.651,0
C-1217136-1 = drill 1.397 pad 3.937: 1 0,2.54; 2 0,-2.54
T101MH9AVBE = drill 1.092 pad 2.032: 1 0,0; 2 2.54,0; 3 5.08,0; H1 -5.08,0
LED3MM = drill 1 pad 1.6 square: A -1.27,0 | drill 1 pad 1.6: K 1.27,0
D5.4X7.5 = drill 1.6 pad 2.4 square: 1 3,0 | drill 1.6 pad 2.4: 2 -3,0
DO-214AC = smd 2.007 x 2.007: A 2.095,0; K -2.095,0
8198 = drill 1.778: 1 -3.962,0; 2 3.962,0
M47118B011000G = drill 2.1 pad 3.15: 1 0,6.295
1724480010 = drill 1.8 pad 2.7 square: 1 0,0 | drill 1.8 pad 2.7: 2 -4.2,0; 3 -8.4,0; 4 -12.6,0; 5 -16.8,0; 6 0,5.5; 7 -4.2,5.5; 8 -8.4,5.5; 9 -12.6,5.5; 10 -16.8,5.5 | hole 3: 0,-7.3; -16.8,-7.3
PAD_M3.0 = drill 0.305 pad 0.711: 1 0,2.175; 2 1.538,1.538; 3 2.175,0; 4 1.538,-1.538; 5 0,-2.175; 6 -1.538,-1.538; 7 -2.175,0; 8 -1.538,1.538 | drill 3.2 pad 5.5: P 0,0
TO220AB_BL = drill 1.372 pad 1.905 square: 1 -2.54,0 | drill 1.372 pad 1.905: 2 0,-3.81; 3 2.54,0
SOT23 = smd 0.864 x 1.016: 1 -0.94,-1.003; 2 0.94,-1.003 | smd 0.864 x 1.27: 3 0,1.003
TO3P = drill 1.6 pad 2.4 square: 1 -5.45,0 | drill 1.6 pad 2.4: 2 0,0; 3 5.45,0
POT_3006P = drill 0.787 pad 1.295: 1 6.35,-1.27; 2 -1.27,1.27 | drill 0.787 pad 1.295 square: 3 -6.35,-1.27
R1206 = smd 1.524 x 1.524: 1 -1.651,0; 2 1.651,0
R1206_OPEN = smd 1.524 x 1.524: 1 -1.651,0; 2 1.651,0
5227161-1_CHG = drill 0.914 pad 1.676: 1 0,-8.89; 2 -2.54,-8.89; 3 0,-6.35; 4 2.54,-8.89 | drill 2.007 pad 3.048: H1 -5.08,-3.81; H2 5.08,-3.81; H3 -5.08,-13.97; H5 -5.08,0; H6 5.08,0
SOIC16-W = smd 0.61 x 2.184: 1 -4.445,-4.763; 2 -3.175,-4.763; 3 -1.905,-4.763; 4 -0.635,-4.763; 5 0.635,-4.763; 6 1.905,-4.763; 7 3.175,-4.763; 8 4.445,-4.763; 9 4.445,4.763; 10 3.175,4.763; 11 1.905,4.763; 12 0.635,4.763; 13 -0.635,4.763; 14 -1.905,4.763; 15 -3.175,4.763; 16 -4.445,4.763
SOIC8-N = smd 0.635 x 2.388: 1 -1.905,-2.54; 2 -0.635,-2.54; 3 0.635,-2.54; 4 1.905,-2.54; 5 1.905,2.54; 6 0.635,2.54; 7 -0.635,2.54; 8 -1.905,2.54
SOIC8-N' = smd 0.635 x 2.388: 1 -1.905,-2.489; 2 -0.635,-2.489; 3 0.635,-2.489; 4 1.905,-2.489; 5 1.905,2.489; 6 0.635,2.489; 7 -0.635,2.489; 8 -1.905,2.489
DPAK = smd 1.422 x 1.829: 1 -2.286,-3.683; 3 2.286,-3.683 | smd 5.588 x 5.842: 4 0,3.683

### Placement (x,y rotation side)
C1  55.12,79.39 90 bottom
C2  25.15,21.99 90 bottom
C3  13.59,29.1 0 bottom
C4  47.88,38.88 90 bottom
C5  22.61,39 180 bottom
C6  16,14.37 270 bottom
C7  4.83,20.59 270 bottom
C8  42.8,33.03 270 bottom
C9  42.8,55.01 270 bottom
C10  45.34,55.01 270 bottom
C11  45.34,33.03 270 bottom
C12  50.42,53.35 270 bottom
C13  41.91,85.87 180 bottom
C14  50.04,79.39 270 bottom
C15  55.5,50.05 180 bottom
C16  50.42,31.38 270 bottom
C17  55.5,27.95 180 bottom
C18  44.96,99.06 90 bottom
C21  50.04,63.9 180 bottom
C22  44.2,63.9 180 bottom
C25  22.61,94.63 180 bottom
C28  34.29,84.47 180 bottom
C29  44.2,94.12 180 bottom
C31  25.53,63.64 180 bottom
C40  41.4,117.63 180 bottom
C60  35.31,117.63 180 bottom
CAP_HV_NEG  46.99,7.37 0 top
CAP_HV_NEG_GND  41.91,7.37 180 top
CAP_HV_POS  74.93,7.37 0 top
CAP_HV_POS_GND  69.85,7.37 0 top
CD  26.42,53.48 270 bottom
CI  23.88,59.32 270 bottom
D  8.95,48.4 0 top
D1  35.31,121.19 0 top
D2  84.71,43.58 0 top
D3  84.71,52.72 180 top
D4  107.95,94.38 270 top
D5  114.05,94.38 90 top
D6  16.89,21.99 90 bottom
D7  47.37,78.5 270 bottom
D8  13.97,21.99 270 bottom
D9  4.83,14.37 90 bottom
D10  41.91,83.2 180 bottom
D11  7.75,14.37 270 bottom
GND  75.44,110.27 90 top
HS1  100.33,66.42 270 top
HS2  100.33,28.83 270 top
HS3  58.42,5.59 180 top
HS4  86.36,5.59 180 top
I  8.95,60.09 0 top
J1  48.77,110.1 180 top
L_GND  84.33,110.27 270 top
L_POS  102.11,110.27 270 top
LV_GND  93.22,110.27 90 top
P  8.95,71.77 0 top
P1  4,4 0 top
P2  113,4 0 top
P3  113,120 0 top
P4  4,120 0 top
Q1  58.42,5.59 180 top
Q2  86.36,5.59 180 top
Q3  34.29,20.97 90 bottom
Q4  30.23,16.65 90 bottom
Q5  100.33,66.42 270 top
Q6  100.33,28.83 270 top
R1  11.18,77.61 0 top
R2  55.12,87.77 90 bottom
R3  11.18,65.93 0 top
R4  11.18,54.24 0 top
R5  11.18,106.57 0 top
R6  11.18,112.16 0 top
R7  52.58,87.77 90 bottom
R8  42.42,99.06 90 bottom
R9  50.04,87.77 90 bottom
R10  54.36,75.07 0 bottom
R11  34.29,69.84 180 bottom
R12  25.53,66.94 180 bottom
R13  52.58,79.39 270 bottom
R14  29.46,20.21 180 bottom
R15  44.2,60.34 180 bottom
R16  35.31,24.14 0 bottom
R17  5.59,67.2 180 bottom
R18  41.15,24.14 180 bottom
R19  11.18,42.56 0 top
R20  43.69,41.8 180 bottom
R21  34.8,103.01 270 bottom
R22  22.23,55.13 180 bottom
R23  43.69,44.34 180 bottom
R24  33.53,11.05 180 bottom
R25  33.53,13.59 0 bottom
R26  39.37,13.59 180 bottom
R27  27.69,13.59 180 bottom
R28  41.4,120.17 0 bottom
R29  37.34,103.01 270 bottom
R30  35.31,26.68 180 bottom
R31  60.71,53.99 270 bottom
R32  25.91,87.01 180 bottom
R34  50.04,60.34 180 bottom
R35  22.61,84.47 180 bottom
R36  31.24,56.78 180 bottom
R37  60.71,32.02 270 bottom
R38  22.61,92.09 180 bottom
R39  58.8,47.51 0 bottom
R40  47.88,33.03 90 bottom
R41  22.61,97.17 180 bottom
R42  18.41,98.06 90 bottom
R43  34.29,87.01 180 bottom
R44  58.8,25.41 0 bottom
R45  22.61,99.71 180 bottom
R46  35.81,45.1 0 bottom
R47  25.91,102.25 180 bottom
R48  27.18,31.38 270 bottom
R49  26.42,59.32 270 bottom
R50  24.64,31.38 270 bottom
R51  22.61,35.96 0 bottom
R52  11.18,34.69 0 top
R53  43.69,28.84 0 bottom
R54  34.54,30.37 0 bottom
R55  29.46,26.68 0 bottom
R56  29.46,24.14 0 bottom
R57  11.18,29.1 0 top
R58  34.29,81.93 0 bottom
R59  47.88,55.01 90 bottom
R61  46.74,84.72 270 bottom
R64  13.59,26.56 180 bottom
R65  7.75,20.59 90 bottom
SP/SENSE  3.59,89.3 90 top
U1  62.74,83.2 270 bottom
U2  34.54,36.97 270 bottom
U3  21.08,21.99 180 bottom
U4  11.94,14.37 180 bottom
U5  BUF634  [SOIC8-N']  55.5,53.99 270 bottom
U6  BUF634  [SOIC8-N']  55.5,32.02 270 bottom
U7  34.54,93.87 270 bottom
U8  34.54,63.39 270 bottom
U12  41.91,76.98 180 bottom
U$87  [IFUNAM]  47.75,78.61 0 top
U$88  [LANMAC_2.0]  45.21,70.99 0 top

### Tracks (layer width: path | path; a pad name or v marks a point on that pad's centre or on a via)
+5V
  Bottom 0.508: U1.10 56.77,80.03 56.12,79.38 55.75,79.38 55.12,78.74 C1.1 R13.2 | R13.2 52.58,75.2 R10.2 | R13.2 52.58,78.88 52.07,79.39 50.55,79.39 50.04,79.9 C14.1 48.01,83.07 R61.2
+12V
  Bottom 0.508: R52.1 15.24,31.13 C3.1 R64.2 16.26,26.56 R57.1
+15V  (via drill 0.51)
  Top 0.508: C2.1 25.15,26.56 30.35,31.77 49.15,31.77 v50.42,33.03 50.42,34.69 C4.1 47.88,40.53 50.42,43.07 C12.1 50.42,56.02 v42.55,63.9 v42.55,94.12 42.55,102.12 45.02,104.6 J1.6
  Bottom 0.508: v42.55,63.9 42.42,64.02 U8.4 | C2.1 25.15,18.68 23.88,17.41 19.73,17.41 19.18,17.97 U3.8 17.34,19.45 D6.K | D1.A 33.66,120.81 C60.1 33.66,115.35 44.4,104.6 J1.6 | C4.1 47.84,37.61 U2.4 | U5.7 50.8,54.62 C12.1 | U6.7 50.8,32.65 v50.42,33.03 | U12.1 39.62,83.01 D10.K 40.26,83.64 C13.1 40.26,86.33 42.55,88.62 v42.55,94.12 42.16,94.5 U7.4
  other vias: 47.88,37.23 25.15,20.34 50.42,55.01
-12V
  Bottom 0.508: R52.3 R57.3 C7.1 R65.2
-15V  (via drill 0.51)
  Top 0.508: C15.2 C17.2 56.39,27.19 29.84,27.19 28.07,25.41 28.07,18.18 26.67,16.78 22.61,16.78 21.46,17.92 21.46,36.21 C5.2 27.3,42.05 C31.2 24.26,66.69 C25.2 24.26,102.38 28.96,107.08 48.51,107.08 49.94,107.08 J1.2
  Bottom 0.508: U8.13 27.69,64.02 C31.2 | U4.2 U4.3 12.57,14.75 12.95,14.37 | C6.1 16,15.89 14.48,14.37 12.95,14.37 | U4.2 11.3,21.99 7.37,25.92 7.37,36.84 9.02,38.5 17.78,38.5 18.8,37.48 22.73,37.48 C5.2 25.65,37.61 U2.13 | 12.95,14.37 12.57,13.98 U4.6 U4.7 11.3,13.98 10.92,14.37 | U7.13 24.38,94.5 C25.2 | R28.1 C40.2 43.05,115.73 44.99,113.79 51.56,113.79 52.97,112.39 J1.2 | C15.2 57.53,50.43 57.53,52.09 U5.4 60.45,52.09 R31.2 | C17.2 57.99,28.79 U6.4 60.45,30.11 R37.2 | U4.2 11.3,14.75 10.92,14.37 | D11.A 7.75,13.86 8.26,14.37 10.92,14.37
  other vias: 24.26,94.63 27.18,63.64 24.26,39 57.15,27.95 57.15,50.05
CAP_HV_NEG
  Top 1.27: CAP_HV_NEG.2 55.12,4.83 Q1.3
  Bottom 0.813: R26.2 43.31,13.59 CAP_HV_NEG.1 CAP_HV_NEG.2
CAP_HV_POS
  Top 1.27: CAP_HV_POS.2 83.06,4.83 Q2.3
  Bottom 0.813: R30.2 39.37,26.68 40.01,26.05 47.37,26.05 50.8,22.62 65.91,22.62 74.93,13.6 CAP_HV_POS.1 CAP_HV_POS.2
GND
  Top 0.508: J1.7 55.81,107.44 65.57,107.44
  Top 1.27: CAP_HV_POS_GND.1 CAP_HV_POS_GND.2 66.48,1.46 44.51,1.46 41.91,4.06 CAP_HV_NEG_GND.1 CAP_HV_NEG_GND.2 50.56,18.56 60.83,18.56 66.93,24.65 66.93,61.71 55.09,73.55 55.09,94.12 J1.10 | J1.5 65.57,107.44 J1.10 | GND.2 GND.1 73.73,104.6 J1.10
  Bottom 0.508: 20.95,96.66 R41.1 22.24,97.17 22.61,97.54 22.61,100.66 20.91,102.36 17.02,102.36 15.75,103.63 15.75,111.48 16.68,112.41 22.97,112.41 33.06,102.32 33.06,90.21 29.97,87.12 29.97,84.07 28.84,82.95 22.48,82.95 R35.1 20.7,84.22 SP/SENSE.H3 15.02,84.22 SP/SENSE.2 9.94,84.22 SP/SENSE.H1 SP/SENSE.H5 SP/SENSE.H6 | 20.95,96.66 C25.1 R38.1 | 55.37,81.3 U1.11 59.31,81.3 | 55.37,81.3 C1.2 55.12,81.55 | 59.31,81.3 59.83,81.82 59.83,85.85 59.31,86.38 | U1.14 U1.15 59.31,86.38 | 55.37,81.3 55.12,81.55 | 55.12,81.55 53.59,83.07 52.58,83.07 51.56,84.09 50.67,84.09 50.04,84.72 R9.1 | 42.67,73.29 44.26,73.29 D7.A 47.37,76.47 48.77,76.47 C14.2 50.04,74.56 52.07,72.53 57.4,72.53 59.83,74.96 59.83,80.77 59.31,81.3 | 25.53,65.29 C31.1 | 44.2,62.37 41.47,62.37 41.09,62.75 U8.5 36.41,62.75 34.67,61.02 34.67,55.51 33.91,54.75 32,54.75 31.24,55.51 31.24,58.02 31.88,58.65 31.88,62.24 31.37,62.75 | 44.2,62.37 44.32,62.37 C22.2 45.72,63.9 44.2,65.42 41.15,65.42 41.02,65.29 U8.3 | U8.14 25.53,65.29 | U8.14 31.75,65.29 31.75,63.13 31.37,62.75 | 31.37,62.75 U8.12 | 25.53,65.29 25.53,68.02 25.08,68.47 11.68,68.47 10.71,69.44 6.2,69.44 P.H1 | U12.4 41.91,84.22 C13.2 43.81,86.12 43.81,92.18 C29.2 | U7.5 40.64,93.23 41.27,92.6 41.27,88.79 40.39,87.9 38.99,87.9 37.85,86.76 37.85,78.12 42.67,73.29 | U8.14 31.88,65.29 34.29,67.71 34.29,71.52 36.07,73.29 U12.4 | 22.23,21.99 21.72,22.49 U3.3 U3.2 20.45,22.37 20.07,21.99 | 22.23,21.99 23.5,21.99 C2.2 26.87,21.91 29.46,21.91 | 22.23,21.99 21.72,21.48 U3.6 U3.7 20.45,21.61 20.07,21.99 | C4.2 47.88,45.23 47.24,45.86 | 47.24,45.86 43.56,45.86 R23.1 40.39,44.34 38.86,42.81 37.59,42.81 36.07,41.29 36.07,38.08 34.05,36.06 34.05,34.41 31.02,31.38 25.15,31.38 24.64,30.88 R50.2 24.64,28.84 26.8,26.68 R55.2 29.46,26.68 29.46,21.91
  Bottom 0.508: C60.2 C40.1 | C40.1 39.81,117.63 41.4,119.22 41.4,121.7 39.99,123.11 15.53,123.11 4.83,112.41 R6.3 R5.3 3.59,104.06 SP/SENSE.H6 | 20.95,96.66 18.67,96.66 R42.1 13.84,91.84 SP/SENSE.4 | 44.2,62.37 44.2,58.94 43.62,58.37 41.13,58.37 38.35,55.59 38.35,53.25 32.41,47.31 | 59.31,86.38 59.83,86.9 59.83,91.07 52.97,97.93 J1.7 52.97,105.9 J1.1 44.49,110.1 39.75,114.84 C40.1 | C15.1 52.07,50.05 C12.2 47.24,48.53 47.24,45.86 | C17.1 52.2,27.95 C16.2 48.01,27.32 40.51,27.32 39.5,28.34 36.01,28.34 35.31,27.64 35.31,23.19 34.02,21.91 Q3.2 29.46,21.91 | D8.A 13.97,21.22 14.73,21.99 20.07,21.99 | D8.A 13.97,19.32 15.37,17.92 17.14,17.92 17.91,17.16 17.91,14.62 C6.2 15.11,11.83 U4.5 13.84,10.3 13.21,9.67 5.84,9.67 4.83,10.68 D9.K 2.92,14.18 2.92,18.43 3.43,18.94 C7.2 3.56,18.94 2.92,19.57 2.92,36.32 3.43,36.83 5.83,36.83 8.51,39.51 20.45,39.51 C5.1 21.08,39 22.61,40.53 26.42,40.53 28.07,38.88 U2.14 31.88,38.88 32.77,39.77 32.77,43.49 32.41,43.84 32.41,47.31 | C3.2 10.79,29.1 10.03,28.34 10.03,24.78 12.45,22.37 12.45,21.41 D8.A | U12.4 42.67,73.29 | 32.41,47.31 16.71,47.31 14.73,45.33 6.94,45.33 D.H1 2.54,49.74 2.54,56.13 3.87,57.47 I.H1 | Q4.2 29.22,19.02 29.46,19.26 29.46,21.91 | SP/SENSE.H6 SP/SENSE.H2
  pour Bottom (no thermals): 0,124 0,0 59.83,0 59.83,124
HV_NEG  (via drill 0.51)
  Top 0.508: J1.9 52.32,95.56 52.32,70.37 63.37,59.32 63.37,26.81 57.98,21.41 38.11,21.41 35.18,18.48 R25.1
  Bottom 0.508: R25.1 R26.1
  other vias: 35.18,13.59
HV_POS  (via drill 0.51)
  Top 0.508: J1.8 49.4,96.83 49.4,68.09 60.71,56.78 60.71,27.57 57.28,24.14 v33.66,24.14
  Bottom 0.508: R30.1 v33.66,24.14
LV_NEG
  Top 1.27: J1.3 57.17,119.92 59.82,122.57 103.12,122.57 114.05,111.65 D5.1
LV_POS
  Top 1.27: J1.4 61.37,118.03 63.5,120.16 101.85,120.16 107.95,114.06 D4.2
N$1
  Bottom 0.508: U7.1 39.31,99.25 40.77,100.71 R8.2 | R8.2 C18.2 | R8.2 42.42,102.11 41.51,103.01 33.85,103.01 23.43,113.43 16.26,113.43 14.73,111.9 14.73,99.71 | SP/SENSE.3 9.94,94.92 14.73,99.71 | R45.1 18.54,99.71 18.41,99.84 18.29,99.71 R42.2 14.73,99.71
N$2
  Bottom 0.508: U7.15 28.19,97.04 25.53,99.71 R45.2 R47.1
N$3
  Bottom 0.508: U7.16 29.78,98.89 27.56,101.11 R47.2 27.56,103.27 25.53,105.3 R5.1
N$4
  Bottom 0.508: R15.1 42.42,60.21 U8.7 37.47,60.21 36.96,59.7 36.96,53.86 31.5,48.4 D.3 14.03,46.88 13.53,46.37 7.62,46.37 6.1,47.89 6.1,51.7 R4.3
N$5
  Bottom 0.508: U8.1 49.4,67.83 51.69,65.55 C21.2 51.69,60.47 | 51.69,60.47 R34.2 | U2.3 56.45,38.88 58.8,41.23 58.8,48.97 59.88,50.05 62.04,50.05 63.12,51.13 63.12,57.93 60.58,60.47 51.69,60.47
N$6
  Bottom 0.508: R41.2 24.27,97.14 26.12,97.14 27.5,95.77 U7.14
N$7
  Bottom 0.508: R21.1 34.8,106.44 25.27,115.97 14.62,115.97 12.63,113.97 12.63,110.56 R5.2
N$8
  Bottom 0.508: C28.1 R43.1 34.16,88.53 34.16,91.33 34.8,91.96 | 34.8,91.96 R21.2 R29.2 | U7.6 34.8,91.96
N$9
  Bottom 0.508: P1.1 P1.2 P1.3 | P1.3 P1.4 P1.5 | P1.5 P1.6 P1.7 | P1.7 P1.8 P1.1 | P1.P P1.7 | P1.P P1.3 | P1.P P1.1 | P1.P P1.5
N$10
  Bottom 0.508: U7.11 28.09,91.96 24.26,88.13 R32.1 R35.2
N$11
  Bottom 0.508: R6.1 22.99,110.89 32.04,101.83 32.04,91.58 31.15,90.69 U7.10 28.67,90.69 27.93,89.95 27.93,87.38 R32.2
N$12
  Bottom 0.508: R29.1 37.34,107.84 26.67,118.51 13.46,118.51 9.91,114.95 R6.2
N$13
  Bottom 0.508: U1.1 U1.2 | U1.2 U1.3 U1.4 | L_GND.1 L_GND.2 84.33,92.47 78.23,86.38 U1.2
  pour Bottom (no thermals): 66.41,87.95 66.41,83.53 75.6,83.53 arc90 86.54,94.47 86.54,114.23 arc180 82.12,114.23 82.12,96.68 arc-90 73.39,87.95
N$14
  Bottom 0.508: R15.2 R34.1 C21.1 48.39,65.04 46.86,66.56 U8.2 35.94,66.56 | R36.2 32.89,63.52 35.94,66.56 | R11.2 35.94,66.56
N$15
  Bottom 0.508: Q3.3 36.32,20.97 36.96,21.61 R16.1 R18.1
N$16
  Bottom 0.508: R2.1 55.12,84.98 56.26,83.83 U1.13
N$17
  Bottom 0.508: U1.12 55.75,82.56 54.23,84.09 53.47,84.09 52.58,84.98 R7.1
N$18
  Bottom 0.508: R48.2 27.56,30.11 32.64,30.11 R54.2 32.89,31.64 35.18,33.92 35.18,35.45 37.08,37.35 37.08,40.78 37.72,41.42 U2.1 41.66,41.42 R20.1
N$19
  Bottom 0.508: U1.5 U1.6 U1.7 | U1.7 U1.8 | LV_GND.2 LV_GND.1 93.22,88.66 84.58,80.03 U1.7
  pour Bottom (no thermals): 66.41,82.87 66.41,78.45 83.22,78.45 arc90 95.43,90.66 95.43,114.23 arc180 91.01,114.23 91.01,92.87 arc-90 81.01,82.87
N$20
  Bottom 0.508: R23.2 R20.2 43.69,40.15 U2.2
N$21
  Bottom 0.508: R12.1 23.62,67.2 13.59,67.2 10.29,63.9 8.64,63.9 6.73,61.99 | 6.73,61.99 4.06,61.99 2.92,63.13 2.92,66.18 R17.1 2.03,69.1 2.03,77.61 4.83,80.41 34.42,80.41 R58.1 C28.2 R43.2 35.94,89.42 37.21,90.69 U7.7 | 6.73,61.99 6.73,58.69 7.87,57.55 18.16,57.55 R22.1
N$22
  Bottom 0.508: U7.12 27.84,93.23 26.7,92.09 R38.2 21.46,89.3 20.83,89.3 SP/SENSE.1
N$23
  Bottom 0.508: P2.1 P2.2 P2.3 | P2.3 P2.4 P2.5 | P2.5 P2.6 P2.7 | P2.7 P2.8 P2.1 | P2.P P2.1 | P2.P P2.5 | P2.P P2.7 | P2.P P2.3
N$24
  Top 0.813: 95,23.39 95.01,23.38 | 98.04,60.99 98.06,60.97
  Top 1.27: L_POS.1 L_POS.2 102.11,81.67 96.65,76.2 96.65,62.38 98.04,60.99 | 95,23.39 87.71,30.68 D2.1 D3.2 97.27,52.72 100.33,55.78 Q5.3 98.06,60.97 | 95.01,23.38 Q6.3
N$26
  Bottom 0.508: U8.15 27.69,66.56 R12.2 27.18,68.34 26.04,69.48 12.26,69.48 11.49,70.25 P.2 11.49,77.29 R1.2 7.37,78.88 R1.3
N$27
  Bottom 0.508: U8.16 31.88,67.83 32.64,68.59 R11.1 29.62,69.84 27.69,71.77 P.3 14.03,74.82 15.56,76.34 R1.1
N$29
  Bottom 0.508: R46.1 39.5,45.1 45.34,50.94 C10.2 R59.1 U5.6 54.99,53.35 55.5,52.85 55.5,48.27 56.26,47.51 R39.2
N$30
  Bottom 0.508: U8.11 26.42,61.48 25.91,60.98 R49.1 CI.1 21.21,60.98 R3.1 14.41,64.66 11.49,61.74 I.2
N$31
  Bottom 0.508: R49.2 27.3,56.78 R36.1 | U8.10 28.32,60.21 26.42,58.31 R49.2 | R49.2 CI.2 21.53,57.67 19.11,60.09 I.3
N$32
  Bottom 0.508: R3.2 R17.2 7.11,67.2 7.11,66.94 R3.3
N$36
  Bottom 0.508: U8.6 36.96,61.48 35.81,60.34 35.81,55.13 32.51,51.83 CD.2 18.67,51.83 R4.1 14.99,55.51 R4.2 9.91,52.09 11.49,50.5 D.2
N$38
  Bottom 0.508: R22.2 CD.1
N$41
  Bottom 0.508: U2.10 31.88,33.8 33.02,34.94 33.02,36.72 35.05,38.75 35.05,42.88 35.81,43.64 35.81,46.3 42.8,53.29 C9.2 42.8,54.62 43.18,55.01 47.5,55.01 47.88,55.39 R59.2 50.61,56.66 50.93,56.97 54.55,56.97 55.5,56.02 55.5,54.37 56.52,53.35 U5.3
N$61
  Bottom 0.508: U6.3 56.64,31.38 55.37,32.65 55.37,34.06 54.24,35.19 50.9,35.19 50.39,34.69 R40.2 47.88,33.67 47.24,33.03 43.31,33.03 42.93,32.65 | U2.7 40.83,33.8 41.98,32.65 42.93,32.65 | 42.93,32.65 42.8,32.53 C8.2
N$62
  Bottom 0.508: U5.1 60.45,55.9 R31.1
N$63
  Bottom 0.508: U6.1 60.45,33.92 R37.1
N$64
  Bottom 0.508: R28.2 38.73,121.19 D1.K
N$65
  Bottom 0.508: D7.K 44.26,80.6 U12.3 44.2,83.01 D10.A 45.47,84.66 45.47,85.11 R61.1
N$66
  Bottom 0.508: U3.1 19.18,24.08 D6.A D8.K 12.57,24.08 11.94,24.72 R64.1
N$67
  Bottom 0.508: D9.A D11.K | U4.1 10.03,16.46 D11.K | D11.K R65.1
N$68
  pour Bottom (no thermals): 117,13.59 103.63,13.59 103.63,44.07 117,44.07
N$69
  Bottom 0.508: P3.1 P3.2 P3.3 | P3.3 P3.4 P3.5 | P3.5 P3.6 P3.7 | P3.7 P3.8 P3.1 | P3.P P3.1 | P3.P P3.7 | P3.P P3.3 | P3.P P3.5
N$70
  pour Bottom (no thermals): 103.63,81.66 103.63,51.18 117,51.18 117,81.66
N$71
  Bottom 0.508: P4.1 P4.8 P4.7 | P4.1 P4.2 P4.3 | P4.3 P4.4 P4.5 | P4.5 P4.6 P4.7 | P4.P P4.1 | P4.P P4.3 | P4.P P4.5 | P4.P P4.7
N$75
  Bottom 0.508: U2.12 24.26,36.34 R51.1 24.51,35.7 24.51,33.16 R50.1
N$79
  Bottom 0.508: R2.2 55.12,93.8 51.51,97.41 C18.1 R8.1 42.05,97.04 U7.2
N$123
  Bottom 0.508: U7.3 47.94,95.77 50.04,93.68 R9.2 R7.2
N$130
  Bottom 0.508: U1.9 57.98,76.22 56.83,75.07 R10.1
N$131
  Bottom 0.508: U1.16 48.9,87.64 48.26,87.01 48.26,84.53 49.72,83.07 50.76,83.07 52.58,81.25 R13.1
N$132
  Bottom 0.508: Q3.1 31.29,20.03 R14.2
N$133
  Bottom 0.813: Q2.1 84.33,1.02 68.07,1.02 65.28,3.81 65.28,12.7 58.86,19.11 51.12,19.11 46.09,24.14 R18.2
N$135
  Top 0.813: 102.36,28.84 102.35,28.83
  Top 1.27: D5.2 114.05,40.53 102.36,28.84 | 102.35,28.83 Q6.2
N$136
  Top 1.27: Q2.2 81.79,13.97 81.79,43.5 D2.2
N$137
  Top 1.27: D3.1 78.99,52.72 75.06,48.78 75.06,26.04 Q1.2
N$138
  Bottom 0.813: Q1.1 56.39,1.02 39.75,1.02 35.18,5.59 R24.2
N$139
  Bottom 0.508: R24.1 R25.2 31.88,14.99 31.23,15.64 Q4.3
N$140
  Bottom 0.508: R27.2 29.22,13.72 Q4.1
N$145
  Top 0.813: 102.11,66.44 102.09,66.42
  Top 1.27: D4.1 107.95,72.28 102.11,66.44 | 102.09,66.42 Q5.2
N$148
  Bottom 0.813: R44.1 73.92,25.41 81.66,33.15 82.79,34.28 Q6.1
N$150
  Bottom 0.813: R39.1 68.96,47.51 93.32,71.87 Q5.1
N$152
  Bottom 0.508: R48.1 27.18,34.43 27.81,35.07 U2.11 31.37,35.07 31.75,35.45 31.75,36.97 33.91,39.13 33.91,44.85 R46.2 33.91,45.35 33.91,46.62 39.69,52.4 39.69,55.07 41.27,56.66 C9.1 C10.1
N$153
  Bottom 0.508: R52.2 R51.2
N$154
  Bottom 0.508: R53.2 41.4,28.84 39.88,30.37 R54.1 36.2,31.51 37.34,32.65 37.34,34.43 37.97,35.07 U2.6 42.42,35.07 C8.1 43.18,35.07 44.96,35.07 C11.1
N$155
  Bottom 0.508: R56.1 R55.1 31.11,27.45 32.51,28.84 34.16,28.84 34.67,29.35 34.67,31.45 36.2,32.97 36.2,34.81 37.72,36.34 U2.5
N$156
  Bottom 0.508: R56.2 27.69,24.14 26.54,25.29 25.15,25.29 20.07,30.37 20.07,33.42 18.54,34.94 14.48,34.94 R57.2
N$157
  Bottom 0.508: R53.1 C11.2 R40.1 U6.6 54.86,31.38 55.37,30.88 55.37,26.18 56.13,25.41 R44.2
N$158
  Bottom 0.508: U2.15 31.37,40.15 31.75,40.53 31.75,43.07 29.61,45.21 17.89,45.21 16.51,43.83 R19.2 5.84,43.83 4.83,42.81 R19.3 3.3,41.29 1.02,43.58 1.02,79.39 3.56,81.93 R58.2
N$159
  Bottom 0.508: U2.16 27.5,41.42 26.99,41.92 20.45,41.92 19.81,41.29 R19.1 8.64,41.29 5.77,38.42 2.74,38.42 1.52,37.21 1.52,12.21 5.08,8.65 21.08,8.65 R27.1 26.04,16.38 27.81,18.16 R14.1

### Text on the board
tPlace: fast_shutdown_v5.0 | 20250104